# EAGLE design MainBoard (EAGLE 7.5.0)
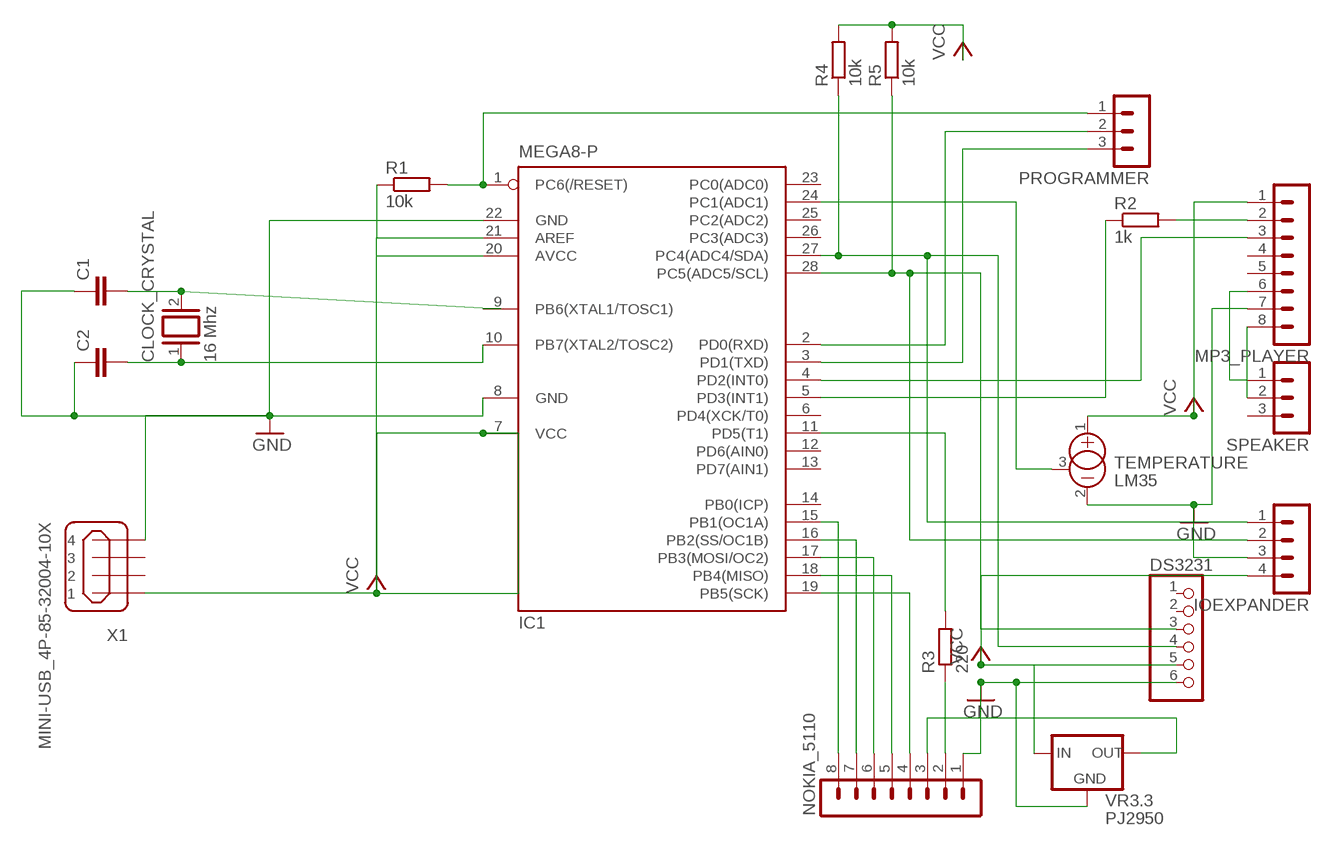
[diagram p0: schematic, sheet 1]

## Parts
C1  C2,5-3  [C2.5-3]
C2  C2,5-3  [C2.5-3]
CLOCK_CRYSTAL  16 Mhz  XTAL/S  [QS]
DS3231  PINHD-1X6  [1X06]
IC1  MEGA8-P  [DIL28-3]
IOEXPANDER  MA04-1  [MA04-1]
MP3_PLAYER  MA08-1W  [MA08-1W]
NOKIA_5110  MA08-1  [MA08-1]
PROGRAMMER  MA03-1  [MA03-1]
R1  10k  R-EU_0204/7  [0204/7]
R2  1k  R-EU_0204/7  [0204/7]
R3  220  R-EU_0204/7  [0204/7]
R4  10k  R-EU_0204/7  [0204/7]
R5  10k  R-EU_0204/7  [0204/7]
SPEAKER  MA03-1  [MA03-1]
TEMPERATURE  LM35  AD590ZR  [TO92]
VR3.3  PJ2950  78LXX  [78LXX]
X1  MINI-USB_4P-85-32004-10X  [85-32004-10X]

## Nets
GND: C1.1 C2.1 DS3231.6 IC1.8(GND) IC1.22(GND) IOEXPANDER.3 MP3_PLAYER.7 NOKIA_5110.1 TEMPERATURE.2(-) VR3.3.GND X1.4
N$1: DS3231.4 IC1.27(PC4(ADC4/SDA)) IOEXPANDER.1 R4.1
N$2: DS3231.3 IC1.28(PC5(ADC5/SCL)) IOEXPANDER.2 R5.1
N$3: IC1.24(PC1(ADC1)) TEMPERATURE.3(CAN)
N$4: C1.2 CLOCK_CRYSTAL.2 IC1.9(PB6(XTAL1/TOSC1))
N$5: C2.2 CLOCK_CRYSTAL.1 IC1.10(PB7(XTAL2/TOSC2))
N$6: IC1.4(PD2(INT0)) MP3_PLAYER.3
N$7: IC1.1(PC6(/RESET)) PROGRAMMER.1 R1.2
N$8: IC1.2(PD0(RXD)) PROGRAMMER.2
N$9: IC1.3(PD1(TXD)) PROGRAMMER.3
N$10: MP3_PLAYER.2 R2.2
N$11: IC1.5(PD3(INT1)) R2.1
N$12: IC1.15(PB1(OC1A)) NOKIA_5110.8
N$13: MP3_PLAYER.6 SPEAKER.1
N$14: MP3_PLAYER.8 SPEAKER.2
N$15: IC1.16(PB2(SS/OC1B)) NOKIA_5110.7
N$16: IC1.17(PB3(MOSI/OC2)) NOKIA_5110.6
N$17: IC1.18(PB4(MISO)) NOKIA_5110.5
N$18: IC1.19(PB5(SCK)) NOKIA_5110.4
N$19: NOKIA_5110.3 VR3.3.OUT
N$20: NOKIA_5110.2 R3.1
N$21: IC1.11(PD5(T1)) R3.2
VCC: DS3231.5 IC1.7(VCC) IC1.20(AVCC) IC1.21(AREF) IOEXPANDER.4 MP3_PLAYER.1 R1.1 R4.2 R5.2 TEMPERATURE.1(+) VR3.3.IN X1.1
Unconnected: DS3231.1 DS3231.2 IC1.6(PD4(XCK/T0)) IC1.12(PD6(AIN0)) IC1.13(PD7(AIN1)) IC1.14(PB0(ICP)) IC1.23(PC0(ADC0)) IC1.25(PC2(ADC2)) IC1.26(PC3(ADC3)) MP3_PLAYER.4 MP3_PLAYER.5 SPEAKER.3 X1.2 X1.3

## Library data of the parts
C1 C2 = capacitor-wima:C: CAPACITOR naming: grid - package width
CLOCK_CRYSTAL = special:XTAL/S: CRYSTAL
DS3231 = pinhead:PINHD-1X6: PIN HEADER
IC1 = atmel:MEGA8-P: MICROCONTROLLER 8 Kbytes FLASH, 1 kbytes SRAM, 512 bytes EEPROM, USART, 4-channel 10 bit ADC, 2-channel 8 bit ADC Pin compatible with Atmega48, ATMega88, ATMega168 Source: avr.lbr; OC_FARNELL: unknown; OC_NEWARK: unknown
IOEXPANDER = con-lstb:MA04-1: PIN HEADER; OC_FARNELL: unknown; OC_NEWARK: unknown
MP3_PLAYER = con-lstb:MA08-1W: PIN HEADER; OC_FARNELL: unknown; OC_NEWARK: unknown
NOKIA_5110 = con-lstb:MA08-1: PIN HEADER; OC_FARNELL: unknown; OC_NEWARK: unknown
PROGRAMMER SPEAKER = con-lstb:MA03-1: PIN HEADER; OC_FARNELL: unknown; OC_NEWARK: unknown
R1-R5 = rcl:R-EU_: RESISTOR, European symbol
TEMPERATURE = linear:AD590ZR: TEMPERATURE SENSOR current output
VR3.3 = v-reg:78LXX: VOLTAGE REGULATOR
X1 = con-cypressindustries:MINI-USB_4P-: MINI USB 4 Pol. Source: www.cypressindustries.com; OC_FARNELL: unknown; OC_NEWARK: unknown

## Board
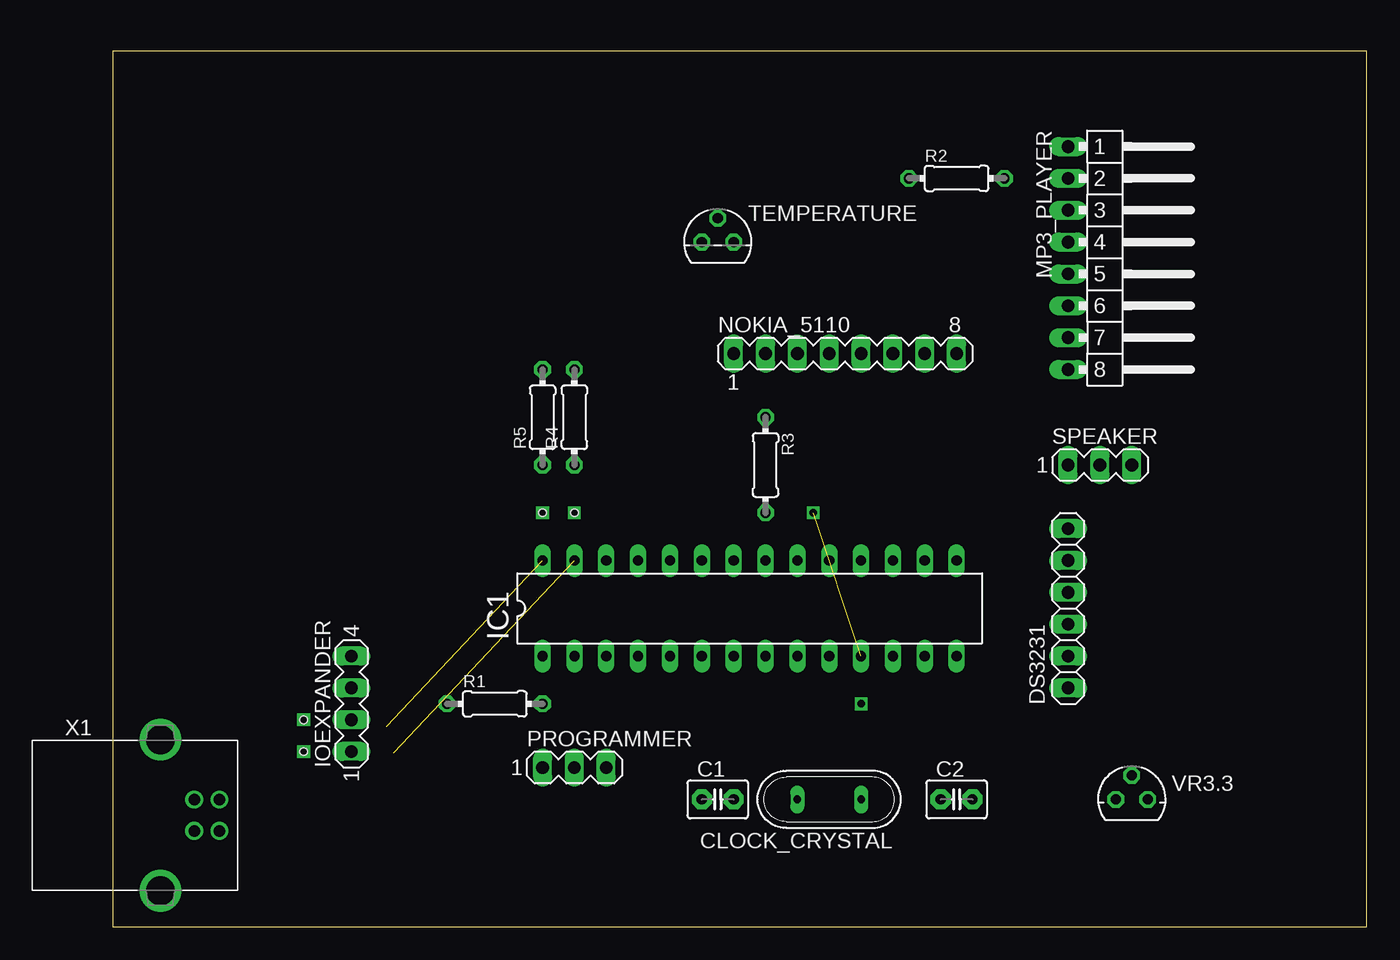
[diagram p1: board, top side]
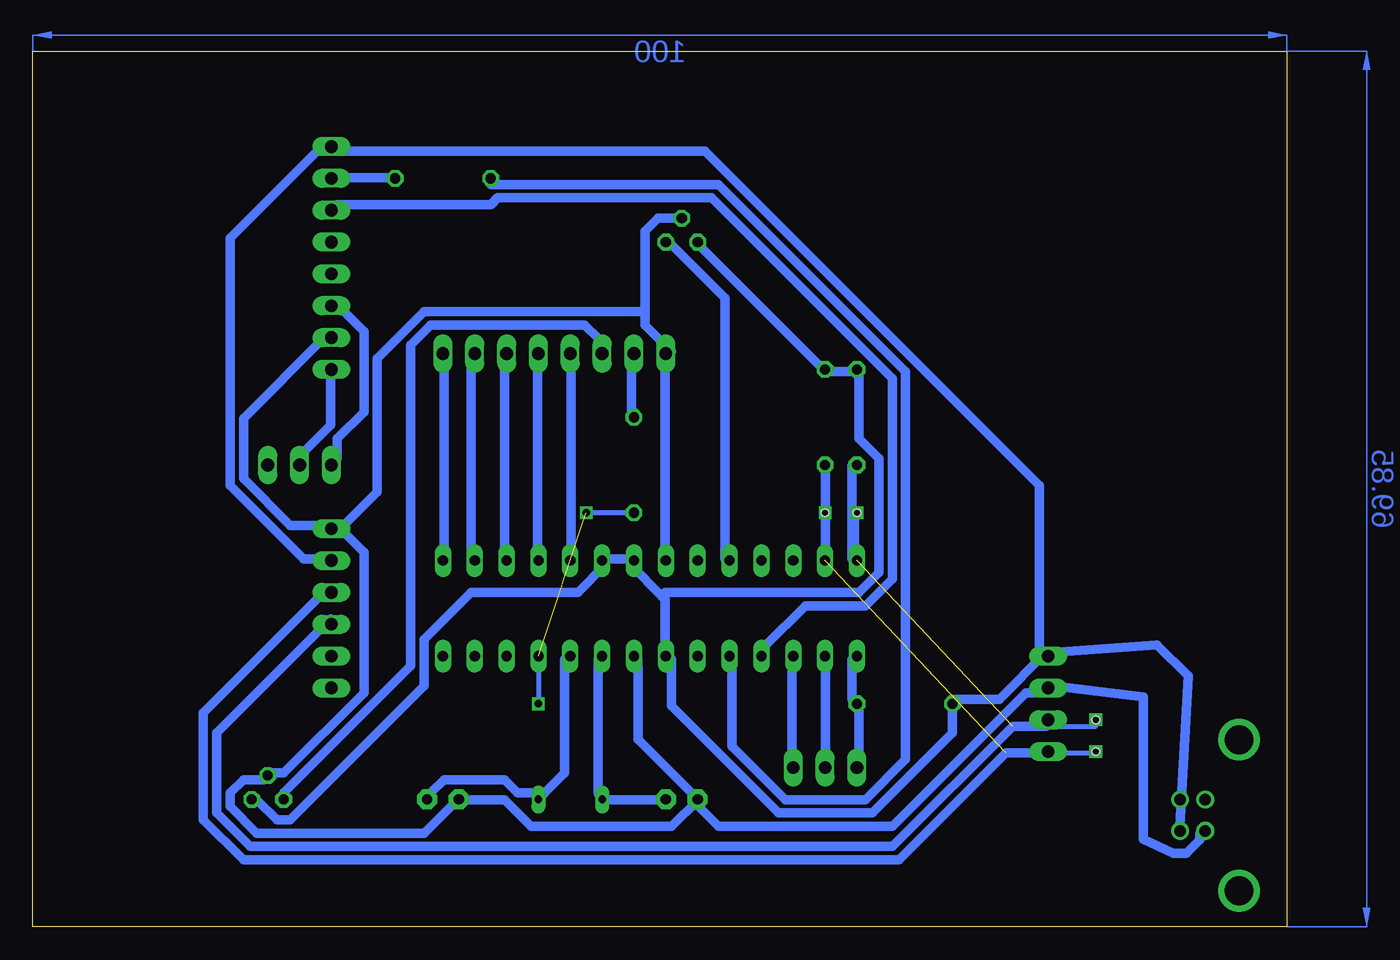
[diagram p2: board, bottom side, seen from below]

Size 100 x 69.84 mm. Coordinates in mm from the lower left corner, seen from the top.
Outline: 0,0 100,0 100,69.84 0,69.84 0,0
Copper layers (1*16): Top 0.035mm / dielectric 1.5mm / Bottom 0.035mm
Design rules "default *": minimum track width 30mil, minimum drill 24mil, track to track 12mil, track to pad 15mil, pad to pad 8mil, via to via 8mil, smd to smd 8mil, copper to edge 40mil, drill to drill 8mil, minimum pad ring 10mil, minimum via ring 8mil, stop-mask expansion 4mil, vias tented up to drill 0mil, thermal gap 10mil
Holes 0.6 mm at 15.24,16.51 15.24,13.97 34.29,33.02 36.83,33.02

### Footprints (pad centres in the part's own frame; a part is rotated, then mirrored left to right if it is on the bottom)
C2.5-3 = drill 0.813 pad 1.6 octagon: 1 -1.27,0; 2 1.27,0
QS = drill 0.61 long: 1 -2.54,0; 2 2.54,0
1X06 = drill 1.016 long: 1 -6.35,0; 2 -3.81,0; 3 -1.27,0; 4 1.27,0; 5 3.81,0; 6 6.35,0
DIL28-3 = drill 0.813 long: 1 -16.51,-3.81; 2 -13.97,-3.81; 3 -11.43,-3.81; 4 -8.89,-3.81; 5 -6.35,-3.81; 6 -3.81,-3.81; 7 -1.27,-3.81; 8 1.27,-3.81; 9 3.81,-3.81; 10 6.35,-3.81; 11 8.89,-3.81; 12 11.43,-3.81; 13 13.97,-3.81; 14 16.51,-3.81; 15 16.51,3.81; 16 13.97,3.81; 17 11.43,3.81; 18 8.89,3.81; 19 6.35,3.81; 20 3.81,3.81; 21 1.27,3.81; 22 -1.27,3.81; 23 -3.81,3.81; 24 -6.35,3.81; 25 -8.89,3.81; 26 -11.43,3.81; 27 -13.97,3.81; 28 -16.51,3.81
MA04-1 = drill 1.016 long: 1 -3.81,0; 2 -1.27,0; 3 1.27,0; 4 3.81,0
MA08-1W = drill 1.016 long: 1 -8.89,0; 2 -6.35,0; 3 -3.81,0; 4 -1.27,0; 5 1.27,0; 6 3.81,0; 7 6.35,0; 8 8.89,0
MA08-1 = drill 1.016 long: 1 -8.89,0; 2 -6.35,0; 3 -3.81,0; 4 -1.27,0; 5 1.27,0; 6 3.81,0; 7 6.35,0; 8 8.89,0
MA03-1 = drill 1.016 long: 1 -2.54,0; 2 0,0; 3 2.54,0
0204/7 = drill 0.813 octagon: 1 -3.81,0; 2 3.81,0
TO92 = drill 0.813 octagon: 1 -1.27,0; 2 0,1.905; 3 1.27,0
78LXX = drill 0.813 octagon: GND 0,1.905; IN 1.27,0; OUT -1.27,0
85-32004-10X = drill 0.92 pad 1.27: 1 4.71,-1.25; 2 4.71,1.25; 3 2.71,1.25; 4 2.71,-1.25 | drill 2.3 pad 3: M1 0,6.02; M2 0,-6.02

### Placement (x,y rotation side)
C1  48.26,10.16 0 top
C2  67.31,10.16 0 top
CLOCK_CRYSTAL  57.15,10.16 180 top
DS3231  76.2,25.4 90 top
IC1  50.8,25.4 0 top
IOEXPANDER  19.05,17.78 90 top
MP3_PLAYER  76.2,53.34 270 top
NOKIA_5110  58.42,45.72 0 top
PROGRAMMER  36.83,12.7 0 top
R1  30.48,17.78 0 top
R2  67.31,59.69 0 top
R3  52.07,36.83 270 top
R4  36.83,40.64 90 top
R5  34.29,40.64 90 top
SPEAKER  78.74,36.83 0 top
TEMPERATURE  48.26,54.61 0 top
VR3.3  81.28,10.16 0 top
X1  3.81,8.89 0 top

### Tracks (layer width: path | path; a pad name or v marks a point on that pad's centre or on a via)
GND
  Bottom 0.762: X1.4 6.93,7.47 6.93,6.93 8,5.87 9.07,5.87 11.46,6.99 11.46,18.34 18.67,19.2 IOEXPANDER.3 19.2,18.67 20.8,18.67 31.47,8 45.34,8 46.94,9.6 C1.1 | IC1.8 51.74,21.34 51.74,14.94 47.47,10.67 C1.1 | C1.1 46.94,10.13 49.07,8 60.27,8 62.41,10.13 65.61,10.13 C2.1 66.14,10.13 68.81,7.47 82.14,7.47 84.28,9.6 84.28,10.67 83.21,11.73 81.61,11.73 VR3.3.GND 81.08,12.27 80.01,12.27 73.61,18.67 73.61,29.87 75.74,32 DS3231.6 | IC1.22 49.61,29.34 49.61,45.34 NOKIA_5110.1 49.07,45.87 51.21,48.01 51.21,49.07 | 51.21,49.07 51.21,55.47 50.14,56.54 48.54,56.54 TEMPERATURE.2 | MP3_PLAYER.7 76.28,46.94 76.81,46.94 83.21,40.54 83.21,35.74 79.48,32 76.28,32 DS3231.6 | 51.21,49.07 68.81,49.07 72.54,45.34 72.54,34.67 75.21,32 DS3231.6
N$1  (via drill 0.6)  (1 unrouted)
  Bottom 0.406: 22.4,13.87 15.24,13.87 v15.24,13.97 | IC1.27 v36.83,33.02
  Bottom 0.762: DS3231.4 76.81,26.67 86.41,17.07 86.41,8.53 83.21,5.33 30.94,5.33 22.4,13.87 19.2,13.87 IOEXPANDER.1 | IC1.27 36.8,29.34 36.8,36.8 R4.1
N$2  (via drill 0.6)  (1 unrouted)
  Bottom 0.406: 21.87,16 15.24,16 v15.24,16.51 | IC1.28 v34.29,33.02
  Bottom 0.762: IOEXPANDER.2 19.2,16 21.87,16 31.47,6.4 82.68,6.4 85.34,9.07 85.34,15.47 76.28,24.54 DS3231.3 | IC1.28 34.67,29.34 34.67,36.8 R5.1
N$3
  Bottom 0.762: IC1.24 44.81,29.34 44.81,50.14 49.07,54.41 TEMPERATURE.3
N$4
  Bottom 0.762: C1.2 49.61,10.13 54.41,10.13 CLOCK_CRYSTAL.2 54.94,10.67 54.94,21.34 IC1.9
N$5
  Bottom 0.762: C2.2 68.28,10.67 67.21,11.73 62.41,11.73 61.34,10.67 59.74,10.67 CLOCK_CRYSTAL.1 59.21,10.67 57.61,12.27 57.61,21.34 IC1.10
N$6
  Bottom 0.762: IC1.4 41.6,21.87 41.6,22.4 38.41,25.6 33.6,25.6 31.47,27.74 31.47,43.74 45.87,58.14 62.94,58.14 63.48,57.61 75.74,57.61 MP3_PLAYER.3
N$7
  Bottom 0.762: IC1.1 34.67,21.34 34.67,18.14 R1.2 34.14,17.6 34.14,12.8 PROGRAMMER.1
N$8
  Bottom 0.762: IC1.2 36.8,21.34 36.8,12.8 PROGRAMMER.2
N$9
  Bottom 0.762: IC1.3 39.47,21.34 39.47,12.8 PROGRAMMER.3
N$10
  Bottom 0.762: R2.2 71.48,59.74 75.74,59.74 MP3_PLAYER.2
N$11
  Bottom 0.762: IC1.5 44.27,21.34 44.27,14.4 40.01,10.13 33.6,10.13 30.4,13.34 30.4,44.27 45.34,59.21 63.48,59.21 R2.1
N$12
  Bottom 0.762: IC1.15 67.21,29.34 67.21,45.34 NOKIA_5110.8
N$13
  Bottom 0.762: SPEAKER.1 75.74,37.34 75.74,38.94 73.61,41.07 73.61,47.47 75.74,49.61 MP3_PLAYER.6
N$14
  Bottom 0.762: MP3_PLAYER.8 76.28,44.27 76.28,40.01 78.94,37.34 SPEAKER.2
N$15
  Bottom 0.762: IC1.16 65.08,29.34 65.08,45.34 NOKIA_5110.7
N$16
  Bottom 0.762: IC1.17 62.41,29.34 62.41,45.34 NOKIA_5110.6
N$17
  Bottom 0.762: IC1.18 59.74,29.34 59.74,45.34 NOKIA_5110.5
N$18
  Bottom 0.762: IC1.19 57.07,29.34 57.07,45.34 NOKIA_5110.4
N$19
  Bottom 0.762: VR3.3.OUT 80.01,10.67 69.88,20.8 69.88,46.41 68.28,48.01 56.01,48.01 54.94,46.94 54.94,45.87 NOKIA_5110.3
N$20
  Bottom 0.762: R3.1 52.27,41.07 52.27,45.34 NOKIA_5110.2
N$21  (via drill 0.6)  (1 unrouted)
  Bottom 0.406: R3.2 v55.88,33.02 | IC1.11 59.69,17.78
N$22  (via drill 0.6)
  other vias: 59.69,17.78
VCC
  Bottom 0.762: DS3231.5 76.28,29.34 78.41,29.34 84.28,35.2 84.28,54.94 77.34,61.87 76.28,61.87 MP3_PLAYER.1 75.74,61.87 46.41,61.87 19.74,35.2 19.74,21.87 IOEXPANDER.4 | IOEXPANDER.4 19.2,21.87 22.94,18.14 26.67,18.14 R1.1 26.67,15.47 33.07,9.07 40.54,9.07 49.07,17.6 49.07,21.34 IC1.7 49.61,21.87 49.61,26.14 49.87,26.4 | X1.1 8.53,8 7.85,20.02 10.39,22.48 18.67,21.87 IOEXPANDER.4 | TEMPERATURE.1 46.94,54.41 37.34,44.81 R4.2 36.8,44.27 34.67,44.27 R5.2 34.14,44.27 34.14,38.94 32.54,37.34 32.54,28.27 34.14,26.67 49.61,26.67 49.87,26.4 | 49.87,26.4 52.27,28.8 IC1.21 52.27,29.34 54.41,29.34 IC1.20 54.41,28.8 56.54,26.67 65.08,26.67 68.81,22.94 68.81,19.2 79.48,8.53 80.54,8.53 82.14,10.13 VR3.3.IN
(copper drawn outside any net)
  shapes: Bottom area x2